# Altium schematic sheet 10.RELAY.SchDoc: RELAY
size A; SheetNumber: 10; SheetTotal: 16
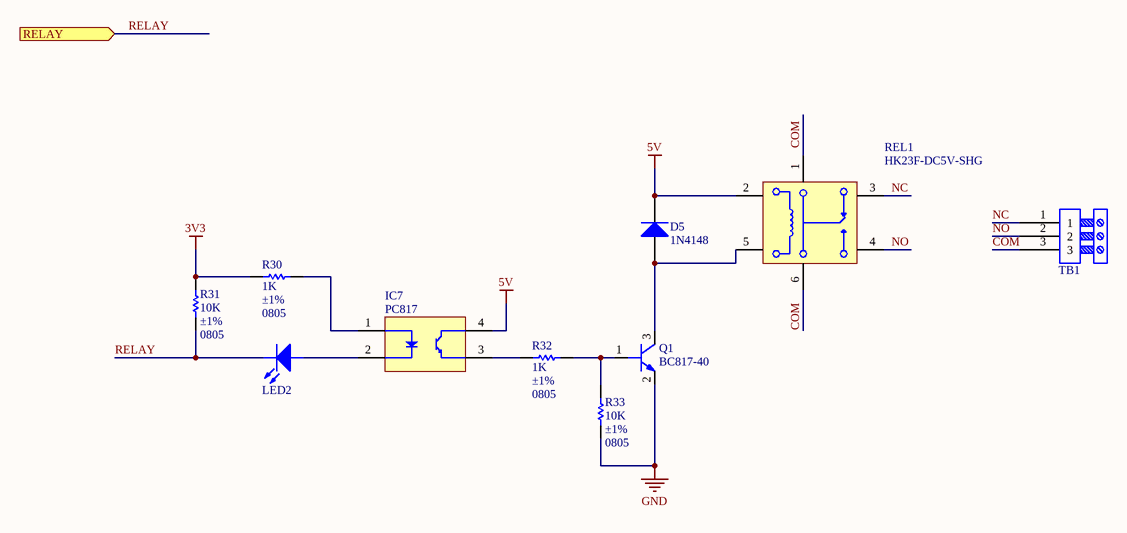
[diagram p0: 10.RELAY.SchDoc]

## Parts
D5  value 1N4148  [SOD323]  (hidden comment: DIODE)
IC7  PC817  [SMD-4]
LED2  LED  [LEDC2012X70N_EIA0805_RED]  (value not drawn)
Q1  value BC817-40  [SOT95P230X110-3N_SOT-23]  (hidden comment: BC817)
R30  value 1K  Tolerance: ±1%  Package / Case: 0805  [RESC2013X65N_EIA0805]  (hidden comment: RES)
R31  value 10K  Tolerance: ±1%  Package / Case: 0805  [RESC2013X65N_EIA0805]  (hidden comment: RES)
R32  value 1K  Tolerance: ±1%  Package / Case: 0805  [RESC2013X65N_EIA0805]  (hidden comment: RES)
R33  value 10K  Tolerance: ±1%  Package / Case: 0805  [RESC2013X65N_EIA0805]  (hidden comment: RES)
REL1  HK23F-DC5V-SHG  [HUIKE_HK23F-DC5V-SHG]
TB1  TB3_EURO  [TB3_EURO]  (value not drawn)

## Ports
RELAY (in)

## Nets
3V3: R30.1 R31.1
5V: D5.1(K) IC7.4 REL1.2
GND: Q1.2(E) R33.2
COM: REL1.1 REL1.6 TB1.3
NC: REL1.3 TB1.1
NO: REL1.4 TB1.2
RELAY: LED2.1 R31.2 ; port RELAY
NetD5_2: D5.2(A) Q1.3(C) REL1.5
NetIC7_1: IC7.1 R30.2
NetIC7_2: IC7.2 LED2.2
NetIC7_3: IC7.3 R32.2
NetQ1_1: Q1.1(B) R32.1 R33.1

## Library data of the parts
D5 = SSEM00021: DIODE GEN PURP 75V 150MA SOD323; Manufacturer: Diodes Incorporated; Manufacturer Part Number: 1N4148WS-7-F; Type: Standard; Cost x10 ($): 0.15500; Cost x100 ($): 0.08480; Cost x1000 ($): 0.03554; Distrubutor: Digikey; Lead Time: 1 (Unlimited); Cost x1 ($): 0.17000; Part Number: SSEM00021; Voltage: 75V; Category: Discrete Semiconductor Products; Family: Diodes - Rectifiers - Single; Package / Case: SC-76, SOD-323; Distributor Part Number: 1N4148WS-FDICT-ND; ROHS: YES; Datasheet Link: http://www.digikey.com/product-detail/en/diodes-incorporated/1N4148WS-7-F/1N4148WS-FDICT-ND/815281; Moisture Sensitivity Level (MSL): 6 Weeks; Part Status: Active; Quantity: 0
IC7 = SISO00004: OPTOISOLTR 5KV TRANSISTOR 4-SMD; Manufacturer: Everlight Electronics Co Ltd; Manufacturer Part Number: EL817(S)(C)(TD)-G; Voltage - Isolation: 5000Vrms; Cost x10 ($): 0.11100; Distrubutor: Digikey; Lead Time: 12 Weeks; Part Number: SISO00004; Value: PC817; Category: Isolators; Family: Optoisolators - Transistor, Photovoltaic Output; Package / Case: 4-SMD, Gull Wing; Type: General Purpose; Cost x100 ($): 0.11100; Cost x1000 ($): 0.11100; Distributor Part Number: EL817(S)(C)(TD)-G-ND; ROHS: YES; Distributor Link: http://www.digikey.com/product-detail/en/everlight-electronics-co-ltd/EL817(S)(C)(TD)-G/EL817(S)(C)(TD)-G-ND/2693421; Quantity: 0; Cost x1 ($): 0.11100
LED2 = SOPT00004: LED SUPER RED CLR THIN 0805 SMD; Manufacturer: Lite-On Inc; Manufacturer Part Number: LTST-C171KRKT; Value: LED_RED; Cost x10 ($): 0.24800; Cost x100 ($): 0.13500; Cost x1000 ($): 0.05850; Distrubutor: Digikey; Cost x1 ($): 0.32000; Part Number: SOPT00004; Package / Case: 0805 (2012 Metric); Category: Optoelectronics; Family: LED Indication - Discrete; Type: LED; Distributor Part Number: 160-1427-1-ND; ROHS: YES; Datasheet Link: http://www.digikey.com/product-detail/en/LTST-C171KRKT/160-1427-1-ND/386800; Quantity: 110
Q1 = STRANS00034: TRANS NPN 45V 0.5A SOT23; Manufacturer: NXP Semiconductors; Manufacturer Part Number: BC817-40,215; Ic (Max): 500mA; Vce Saturation (Max) @ Ib, Ic: 700mV @ 50mA, 500mA; Ic Cutoff (Max): 100nA (ICBO); hFE (Min) @ Ic, Vce: 250 @ 100mA, 1V; Power - Max: 250mW; Frequency - Transition: 100MHz; Cost x10 ($): 0.12700; Cost x100 ($): 0.06930; Cost x1000 ($): 0.02905; Distrubutor: Digikey; Lead Time: 6 Weeks; Cost x1 ($): 0.14000; Part Number: STRANS00034; Vce Breakdown (Max): 45V; Mounting Type: SMD; Category: Discrete Semiconductor Products; Family: Transistors (BJT) - Single; Transistor Type: NPN; Package / Case: SOT-23-3, TO-236-3, SC-59; Distributor Part Number: 568-1631-1-ND; ROHS: YES; Datasheet Link: http://www.digikey.com/product-detail/en/nxp-semiconductors/BC817-40,215/568-1631-1-ND/763458; Quantity: 110
R30 R32 = SRES03010074: RES SMD 1K OHM 1% 1/8W 0805; Manufacturer: Yageo; Manufacturer Part Number: RC0805FR-071KL; Power (Watts): 0.125W, 1/8W; Cost x1 ($): 0.10; Cost x10 ($): 0.21; Cost x100 ($): 0.84; Cost x1000 ($): 3.79; Distrubutor: Digikey; Part Number: SRES03010074; Resistance (Ohm): 1K; Category: Resistors; Family: Chip Resistor - Surface Mount; Distributor Part Number: 311-1.00KCRCT-ND; Distributor Link: http://www.digikey.com/product-detail/en/RC0805FR-071KL/311-1.00KCRCT-ND/730391; ROHS: YES; Quantity: 0
R31 R33 = SRES03010098: RES SMD 10K OHM 1% 1/8W 0805; Manufacturer: Yageo; Manufacturer Part Number: RC0805FR-0710KL; Power (Watts): 0.125W, 1/8W; Cost x1 ($): 0.10; Cost x10 ($): 0.21; Cost x100 ($): 0.84; Cost x1000 ($): 3.79; Distrubutor: Digikey; Part Number: SRES03010098; Resistance (Ohm): 10K; Category: Resistors; Family: Chip Resistor - Surface Mount; Distributor Part Number: 311-10.0KCRCT-ND; Distributor Link: http://www.digikey.com/product-detail/en/RC0805FR-0710KL/311-10.0KCRCT-ND/730482; ROHS: YES; Quantity: 0
REL1 = SREL00004: RELAY GEN PURPOSE SPDT 3A 5V; Coil Voltage: 5VDC; Contact Rating (Current): 2A@120VAC/2A@24VDC; Contact Form: SPDT (1 Form C); Part Number: SREL00004; Value: HK23F-DC5V-SHG; Operating Temperature: -30°C ~ 70°C; Type: General Purpose; Category: Relays; Family: Signal Relays, Up to 3 Amps; Mounting Type: Through Hole
TB1 = SCON00134: TERM BLOCK HDR 3POS VERT 3.81MM; Manufacturer: On Shore Technology Inc.; Manufacturer Part Number: EDSTLZ1550/3; Value: TB3-HDR; Pitch: 0.150" (3.81mm); Connector Type: Header, Male Pins, Shrouded (4 Side); Cost x1 ($): 1.15000; Cost x10 ($): 1.01000; Cost x100 ($): 0.87120; Cost x1000 ($): 0.63360; Distrubutor: Digikey; Lead Time: 8 Weeks; Part Number: SCON00134; Category: Connectors, Interconnects; Family: Terminal Blocks - Headers, Plugs and Sockets; Mounting Type: Through Hole; Distributor Part Number: ED1935-ND; Datasheet Link: http://www.digikey.com/product-detail/en/on-shore-technology-inc/EDSTLZ1550-3/ED1935-ND/250542; ROHS: YES; Moisture Sensitivity Level (MSL): 1 (Unlimited); Part Status: Active; Quantity: 0